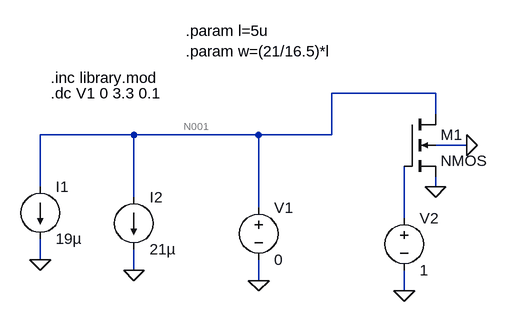
[diagram p0: schematic quiz4.asc]
quiz4.asc, the LTspice schematic file:
Version 4
SHEET 1 880 680
WIRE 624 -16 464 -16
WIRE 624 16 624 -16
WIRE 160 48 16 48
WIRE 352 48 160 48
WIRE 464 48 464 -16
WIRE 464 48 352 48
WIRE 672 64 624 64
WIRE 16 128 16 48
WIRE 624 128 624 112
WIRE 160 144 160 48
WIRE 352 160 352 48
WIRE 576 176 576 96
WIRE 16 240 16 208
WIRE 160 256 160 224
WIRE 352 272 352 240
WIRE 576 288 576 256
FLAG 16 240 0
FLAG 160 256 0
FLAG 352 272 0
FLAG 576 288 0
FLAG 672 64 0
FLAG 624 128 0
SYMBOL current 16 128 R0
WINDOW 123 0 0 Left 0
WINDOW 39 0 0 Left 0
SYMATTR InstName I1
SYMATTR Value 19µ
SYMBOL current 160 144 R0
WINDOW 123 0 0 Left 0
WINDOW 39 0 0 Left 0
SYMATTR InstName I2
SYMATTR Value 21µ
SYMBOL voltage 352 144 R0
WINDOW 123 0 0 Left 0
WINDOW 39 0 0 Left 0
SYMATTR InstName V1
SYMATTR Value 0
SYMBOL voltage 576 160 R0
WINDOW 123 0 0 Left 0
WINDOW 39 0 0 Left 0
SYMATTR InstName V2
SYMATTR Value 1
SYMBOL nmos4 576 16 R0
SYMATTR InstName M1
SYMATTR Value2 l=l w=w
TEXT 32 -40 Left 2 !.inc library.mod
TEXT 32 -16 Left 2 !.dc V1 0 3.3 0.1
TEXT 240 -112 Left 2 !.param l=5u\n.param w=(21/16.5)*l

The netlist it stands for:
* quiz4.asc
I1 N001 0 19µ
I2 N001 0 21µ
V1 N001 0 0
V2 N002 0 1
M1 N001 N002 0 0 NMOS l=l w=w
.model NMOS NMOS
.model PMOS PMOS
.lib standard.mos
.inc library.mod
.dc V1 0 3.3 0.1
.param l=5u
.param w=(21/16.5)*l
.backanno
.end

* Results of the author's LTspice run, read from the files saved beside the schematic
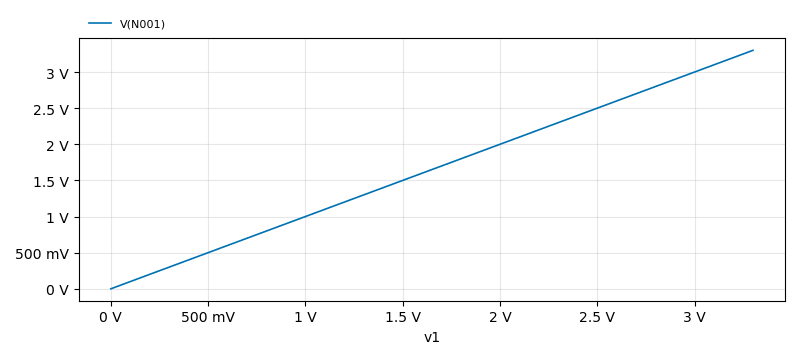
[diagram p1: DC transfer characteristic of quiz4.asc, plotted from the saved traces]
* DC transfer characteristic, 1 run:
*   V(N001): 0 V at v1=0 V, 3.3 V at v1=3.3 V, min 0 V, max 3.3 V